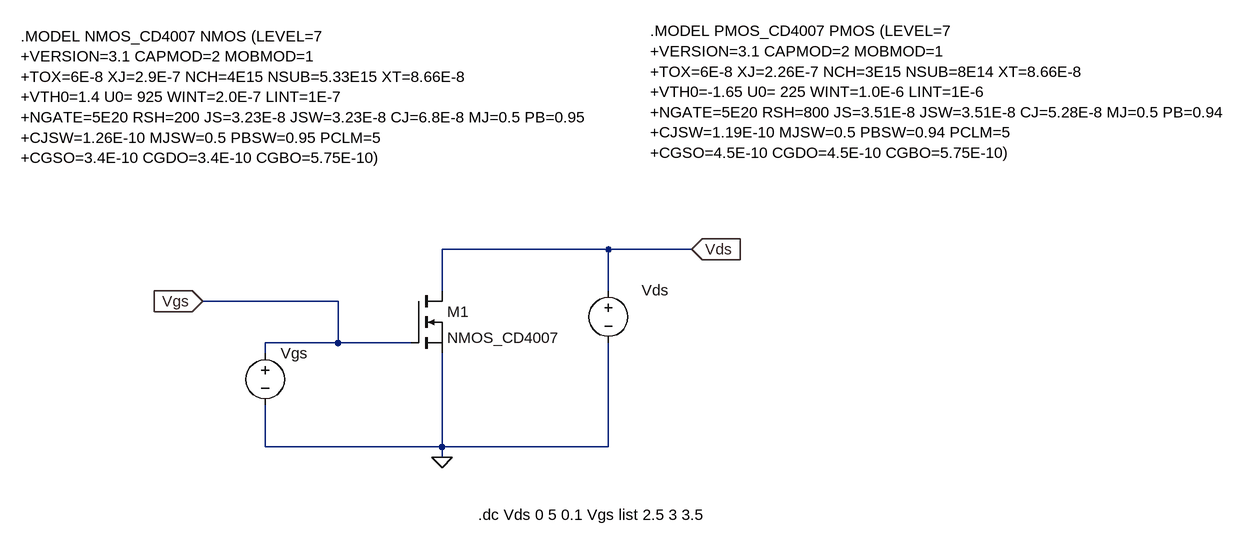
[diagram p0: schematic Simu_C.asc]
Simu_C.asc, the LTspice schematic file:
Version 4.1
SHEET 1 1600 960
WIRE 512 448 256 448
WIRE 640 448 512 448
WIRE 256 512 256 448
WIRE 512 512 512 448
WIRE 96 528 -112 528
WIRE 96 592 96 528
WIRE 96 592 -16 592
WIRE 208 592 96 592
WIRE -16 608 -16 592
WIRE -16 752 -16 688
WIRE 256 752 256 608
WIRE 256 752 -16 752
WIRE 512 752 512 592
WIRE 512 752 256 752
WIRE 256 768 256 752
FLAG 256 768 0
FLAG 640 448 Vds
IOPIN 640 448 In
FLAG -112 528 Vgs
IOPIN -112 528 In
SYMBOL voltage -16 592 R0
WINDOW 3 55 46 Left 2
SYMATTR Value2 AC 1
SYMATTR Value ""
SYMATTR InstName Vgs
SYMBOL lib\\sym\\nmos 208 512 R0
SYMATTR InstName M1
SYMATTR Value NMOS_CD4007
SYMBOL voltage 512 496 R0
WINDOW 39 0 0 Left 0
WINDOW 3 51 43 Left 2
WINDOW 0 51 15 Left 2
SYMATTR Value2 AC 1
SYMATTR Value ""
SYMATTR InstName Vds
TEXT 576 112 Left 2 !.MODEL PMOS_CD4007 PMOS (LEVEL=7\n+VERSION=3.1 CAPMOD=2 MOBMOD=1\n+TOX=6E-8 XJ=2.26E-7 NCH=3E15 NSUB=8E14 XT=8.66E-8\n+VTH0=-1.65 U0= 225 WINT=1.0E-6 LINT=1E-6\n+NGATE=5E20 RSH=800 JS=3.51E-8 JSW=3.51E-8 CJ=5.28E-8 MJ=0.5 PB=0.94\n+CJSW=1.19E-10 MJSW=0.5 PBSW=0.94 PCLM=5\n+CGSO=4.5E-10 CGDO=4.5E-10 CGBO=5.75E-10)
TEXT -392 120 Left 2 !.MODEL NMOS_CD4007 NMOS (LEVEL=7\n+VERSION=3.1 CAPMOD=2 MOBMOD=1\n+TOX=6E-8 XJ=2.9E-7 NCH=4E15 NSUB=5.33E15 XT=8.66E-8\n+VTH0=1.4 U0= 925 WINT=2.0E-7 LINT=1E-7\n+NGATE=5E20 RSH=200 JS=3.23E-8 JSW=3.23E-8 CJ=6.8E-8 MJ=0.5 PB=0.95\n+CJSW=1.26E-10 MJSW=0.5 PBSW=0.95 PCLM=5\n+CGSO=3.4E-10 CGDO=3.4E-10 CGBO=5.75E-10)
TEXT 312 856 Left 2 !.dc Vds 0 5 0.1 Vgs list 2.5 3 3.5

The netlist it stands for:
* Simu_C.asc
Vgs Vgs 0 AC 1
M1 Vds Vgs 0 0 NMOS_CD4007
Vds Vds 0 AC 1
.model NMOS NMOS
.model PMOS PMOS
.lib standard.mos
.MODEL PMOS_CD4007 PMOS (LEVEL=7
+VERSION=3.1 CAPMOD=2 MOBMOD=1
+TOX=6E-8 XJ=2.26E-7 NCH=3E15 NSUB=8E14 XT=8.66E-8
+VTH0=-1.65 U0= 225 WINT=1.0E-6 LINT=1E-6
+NGATE=5E20 RSH=800 JS=3.51E-8 JSW=3.51E-8 CJ=5.28E-8 MJ=0.5 PB=0.94
+CJSW=1.19E-10 MJSW=0.5 PBSW=0.94 PCLM=5
+CGSO=4.5E-10 CGDO=4.5E-10 CGBO=5.75E-10)
.MODEL NMOS_CD4007 NMOS (LEVEL=7
+VERSION=3.1 CAPMOD=2 MOBMOD=1
+TOX=6E-8 XJ=2.9E-7 NCH=4E15 NSUB=5.33E15 XT=8.66E-8
+VTH0=1.4 U0= 925 WINT=2.0E-7 LINT=1E-7
+NGATE=5E20 RSH=200 JS=3.23E-8 JSW=3.23E-8 CJ=6.8E-8 MJ=0.5 PB=0.95
+CJSW=1.26E-10 MJSW=0.5 PBSW=0.95 PCLM=5
+CGSO=3.4E-10 CGDO=3.4E-10 CGBO=5.75E-10)
.dc Vds 0 5 0.1 Vgs list 2.5 3 3.5
.backanno
.end